# EAGLE design Smart bot V2.0 (EAGLE 9.6.2)
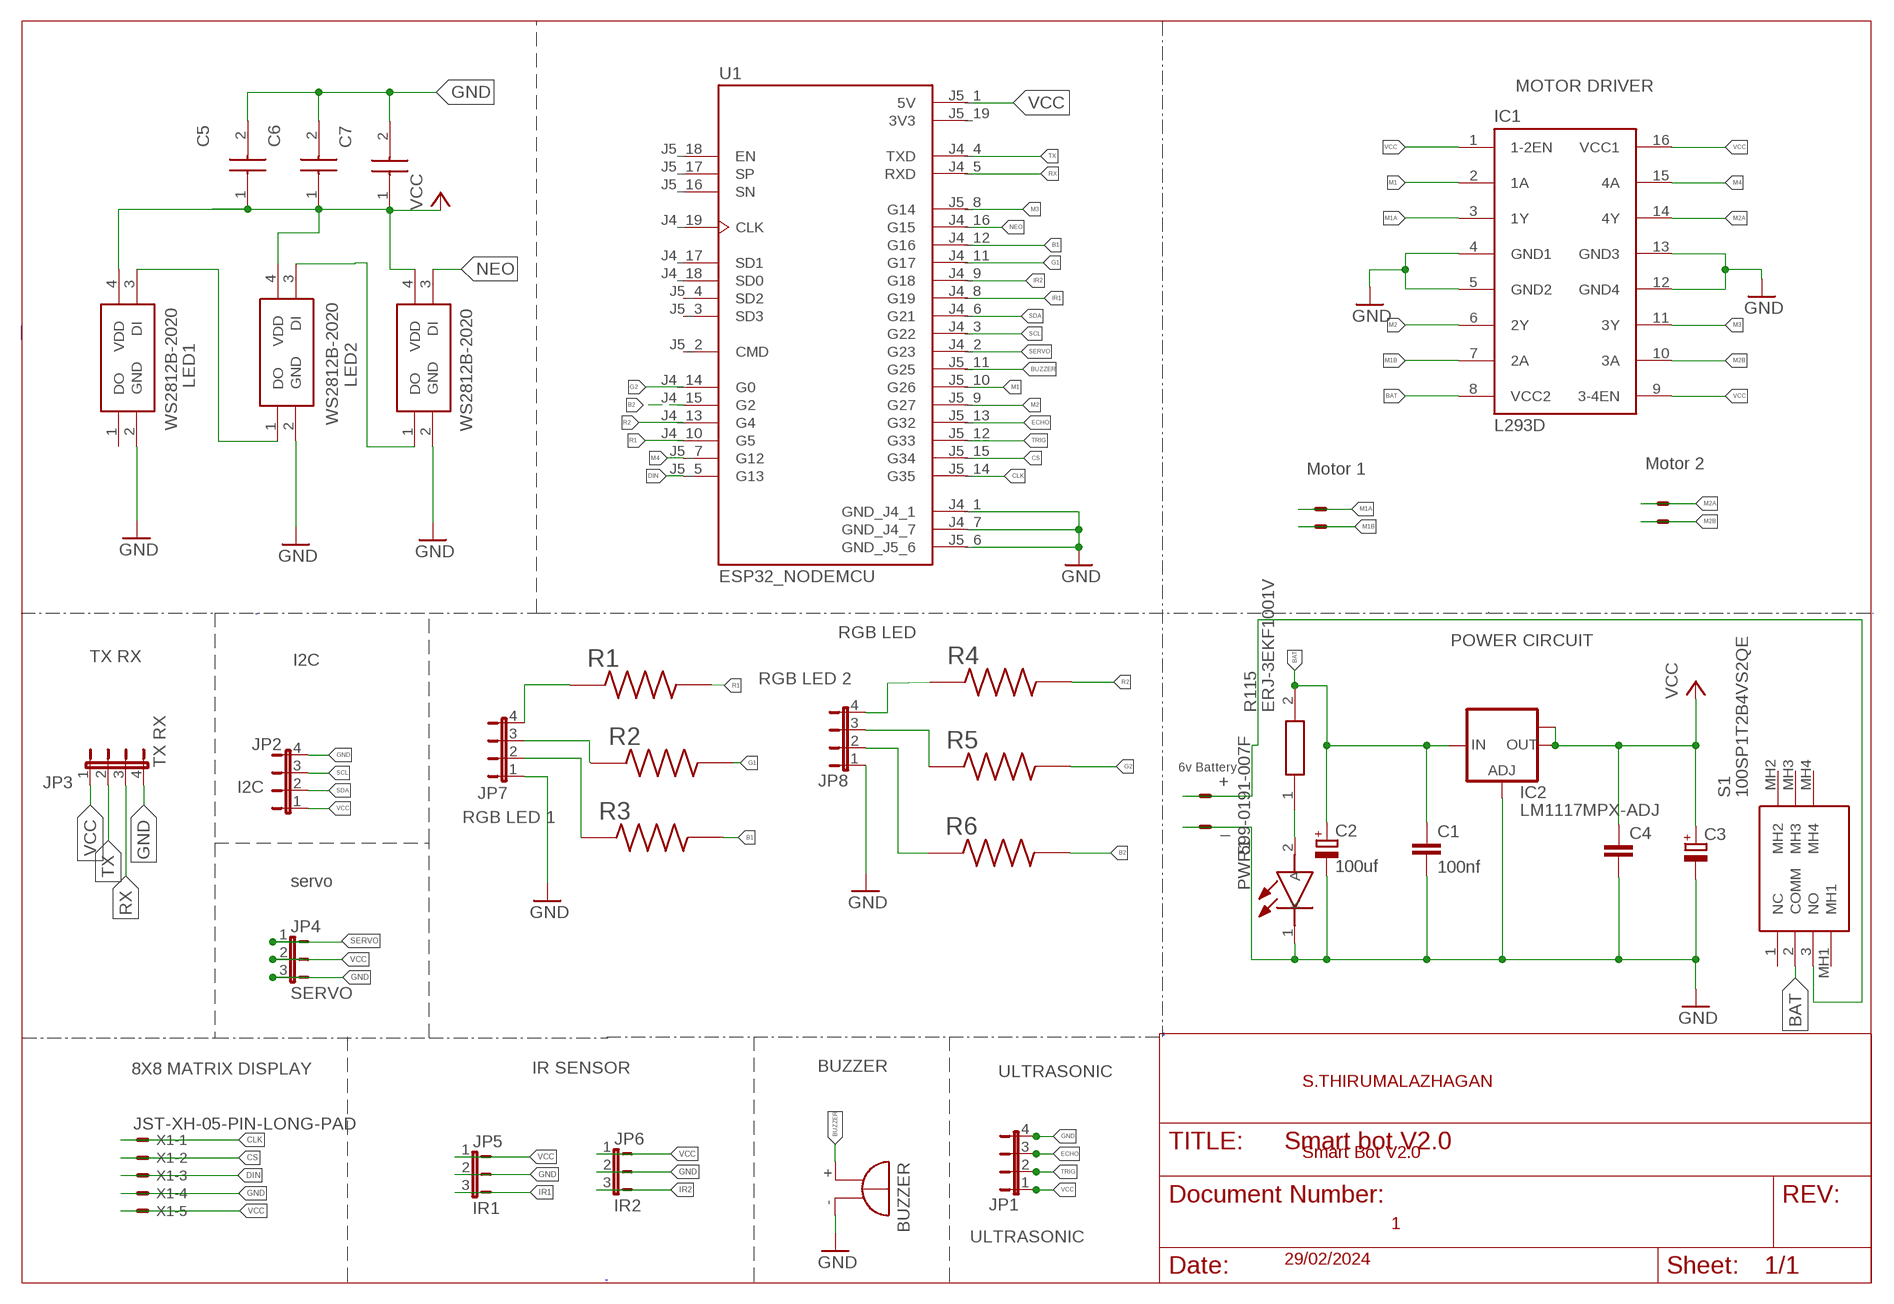
[diagram p0: schematic, sheet 1]

## Parts
6V  JST-XH-02-PIN-LONG-PAD  [JST-XH-02-PACKAGE-LONG-PAD]
BUZZER  F/HMB  [F/HMB]
C1  100nf  C-EUC1206  [C1206]
C2  100uf  CPOL-EUSMCB  [SMC_B]
C3  CPOL-EUSMCB  [SMC_B]
C4  C-EUC1206  [C1206]
C5  C0805X102KMRECAUTO7210  [CAPC2012X98N]
C6  C0805X102KMRECAUTO7210  [CAPC2012X98N]
C7  C0805X102KMRECAUTO7210  [CAPC2012X98N]
IC1  L293D  [DIL16]
IC2  LM1117MPX-ADJ  [SOT223]
JP1  ULTRASONIC  JP4E  [JP4]
JP2  I2C  JP4E  [JP4]
JP3  TX RX  JP4E  [JP4]
JP4  SERVO  JP2E  [JP2]
JP5  IR1  JP2E  [JP2]
JP6  IR2  JP2E  [JP2]
JP7  RGB LED 1  JP4E  [JP4]
JP8  RGB LED 2  JP4E  [JP4]
LED1  WS2812B-2020  [WS2812B2020]
LED2  WS2812B-2020  [WS2812B2020]
LED3  WS2812B-2020  [WS2812B2020]
PWR1  599-0191-007F  [LEDC2012X90N]
R1  RR0306P-101-D  [RESC0603X26N]
R2  RR0306P-101-D  [RESC0603X26N]
R3  RR0306P-101-D  [RESC0603X26N]
R4  RR0306P-101-D  [RESC0603X26N]
R5  RR0306P-101-D  [RESC0603X26N]
R6  RR0306P-101-D  [RESC0603X26N]
R115  ERJ-3EKF1001V  [RESC1608X55N]
S1  100SP1T2B4VS2QE  [100SP1T2B4VS2QE]
U1  ESP32_NODEMCU  [MODULE_ESP32_NODEMCU]
X1  JST-XH-05-PIN-LONG-PAD  [JST-XH-05-PACKAGE-LONG-PAD]
X2  JST-XH-02-PIN-LONG-PAD  [JST-XH-02-PACKAGE-LONG-PAD]
X3  JST-XH-02-PIN-LONG-PAD  [JST-XH-02-PACKAGE-LONG-PAD]

## Nets
6V: 6V.1 S1.3(NO)
B1: R3.2 U1.J4_12(G16)
B2: R6.2 U1.J4_15(G2)
BAT: C1.1 C2.+ IC1.8(VCC2) IC2.3(IN) R115.2 S1.2(COMM)
BUZZER: BUZZER.+ U1.J5_11(G25)
CLK: U1.J5_14(G35) X1.1
CS: U1.J5_15(G34) X1.2
DIN: U1.J5_5(G13) X1.3
ECHO: JP1.3 U1.J5_13(G32)
G1: R2.2 U1.J4_11(G17)
G2: R5.2 U1.J4_14(G0)
GND: 6V.2 BUZZER.- C1.2 C2.- C3.- C4.2 C5.2 C6.2 C7.2 IC1.4(GND1) IC1.5(GND2) IC1.12(GND4) IC1.13(GND3) IC2.1(ADJ) JP1.4 JP2.4 JP3.4 JP4.3 JP5.2 JP6.2 JP7.1 JP8.1 LED1.2(GND) LED2.2(GND) LED3.2(GND) PWR1.1(K) U1.J4_1(GND_J4_1) U1.J4_7(GND_J4_7) U1.J5_6(GND_J5_6) X1.4
IR1: JP5.3 U1.J4_8(G19)
IR2: JP6.3 U1.J4_9(G18)
M1: IC1.2(1A) U1.J5_10(G26)
M1A: IC1.3(1Y) X2.1
M1B: IC1.7(2A) X2.2
M2: IC1.6(2Y) U1.J5_9(G27)
M2A: IC1.14(4Y) X3.1
M2B: IC1.10(3A) X3.2
M3: IC1.11(3Y) U1.J5_8(G14)
M4: IC1.15(4A) U1.J5_7(G12)
N$1: JP7.4 R1.1
N$2: JP7.3 R2.1
N$3: JP7.2 R3.1
N$4: JP8.4 R4.1
N$5: JP8.3 R5.1
N$6: JP8.2 R6.1
N$7: PWR1.2(A) R115.1
N$9: LED1.3(DI) LED2.1(DO)
N$10: LED2.3(DI) LED3.1(DO)
NEO: LED3.3(DI) U1.J4_16(G15)
R1: R1.2 U1.J4_10(G5)
R2: R4.2 U1.J4_13(G4)
RX: JP3.3 U1.J4_5(RXD)
SCL: JP2.3 U1.J4_3(G22)
SDA: JP2.2 U1.J4_6(G21)
SERVO: JP4.1 U1.J4_2(G23)
TRIG: JP1.2 U1.J5_12(G33)
TX: JP3.2 U1.J4_4(TXD)
VCC: C3.+ C4.1 C5.1 C6.1 C7.1 IC1.1(1-2EN) IC1.9(3-4EN) IC1.16(VCC1) IC2.2(OUT) IC2.TAB(OUT1) JP1.1 JP2.1 JP3.1 JP4.2 JP5.1 JP6.1 LED1.4(VDD) LED2.4(VDD) LED3.4(VDD) U1.J5_1(5V) X1.5
Unconnected: LED1.1(DO) S1.1(NC) S1.MH1 S1.MH2 S1.MH3 S1.MH4 U1.J4_17(SD1) U1.J4_18(SD0) U1.J4_19(CLK) U1.J5_2(CMD) U1.J5_3(SD3) U1.J5_4(SD2) U1.J5_16(SN) U1.J5_17(SP) U1.J5_18(EN)

## Notes on the sheet
- MOTOR DRIVER
- Motor 2
- Motor 1
- RGB LED
- POWER CIRCUIT
- TX RX | I2C
- 6v Battery
- +
- _
- servo
- 8X8 MATRIX DISPLAY | IR SENSOR | BUZZER
- ULTRASONIC
- S.THIRUMALAZHAGAN
- Smart Bot V2.0
- 1
- 29/02/2024

## Power pins joined to a net without a drawn wire
3V3: U1.J5_19(3V3)

## Library data of the parts
6V X2 X3 = JST XH Connectors v1-0:JST-XH-02-PIN: JST XH Connector 2 Pin Wire to board connector. Pitch: 2,54 mm, (0.100") Number of pins: 2 Created by Rembrandt Electronics www.rembrandtelectronics.com
BUZZER = buzzer:F/HMB: BUZZER Source: Buerklin; OC_FARNELL: unknown; OC_NEWARK: unknown
C1 C4 = rcl:C-EU: CAPACITOR, European symbol; SPICEPREFIX: C
C2 C3 = rcl:CPOL-EU: POLARIZED CAPACITOR, European symbol; SPICEPREFIX: C
C5-C7 = SamacSys_Parts:C0805X102KMRECAUTO7210: Multilayer Ceramic Capacitors MLCC - SMD/SMT 63V 1000pF X7R 0805 10% AEC-Q200 Source: Datasheet <https://connect.kemet.com:7667/gateway/IntelliData-ComponentDocumentation/1.0/download/specsheet/C0805X102KMRECAUTO7210>; DESCRIPTION: Multilayer Ceramic Capacitors MLCC - SMD/SMT 63V 1000pF X7R 0805 10% AEC-Q200; HEIGHT: 0.98mm; MANUFACTURER_NAME: KEMET; MANUFACTURER_PART_NUMBER: C0805X102KMRECAUTO7210; MOUSER_PART_NUMBER: 80-C0805X102KMREAULR; MOUSER_PRICE-STOCK: https://www.mouser.co.uk/ProductDetail/KEMET/C0805X102KMRECAUTO7210?qs=MLItCLRbWszzMnEf80750Q%3D%3D
IC1 = st-microelectronics:L293D: PUSH-PULL 4 CHANNEL DRIVER; MPN: L293D; OC_FARNELL: 9589619; OC_NEWARK: 56P8249
IC2 = lm1117:LM1117MPX-ADJ
JP1-JP3 JP7 JP8 = jumper:JP4E: JUMPER
JP4-JP6 = jumper:JP2E: JUMPER
LED1-LED3 = SamacSys_Parts:WS2812B-2020: LED; SMD; 2020; RGB; 2x2x0.84mm; 3.75.3V; Lens: transparent; 2kHz Source: Datasheet <https://www.alldatasheet.com/datasheet-pdf/pdf/1134522/WORLDSEMI/WS2812B-2020.html>; DESCRIPTION: LED; SMD; 2020; RGB; 2x2x0.84mm; 3.75.3V; Lens: transparent; 2kHz; HEIGHT: 0.84mm; MANUFACTURER_NAME: Worldsemi; MANUFACTURER_PART_NUMBER: WS2812B-2020
PWR1 = SamacSys_Parts:599-0191-007F: Standard LEDs - SMD SMD 0805 BLUE Source: Datasheet <https://componentsearchengine.com/Datasheets/1/599-0191-007F.pdf>; DESCRIPTION: Standard LEDs - SMD SMD 0805 BLUE; HEIGHT: 0.9mm; MANUFACTURER_NAME: Dialight; MANUFACTURER_PART_NUMBER: 599-0191-007F; MOUSER_PART_NUMBER: 645-599-0191-007F; MOUSER_PRICE-STOCK: https://www.mouser.co.uk/ProductDetail/Dialight/599-0191-007F?qs=gTYE2QTfZfTbWzs5Ohdbbg%3D%3D
R1-R6 = RR0306P-101-D:RR0306P-101-D: Check availability <https://pricing.snapeda.com/parts/RR0306P-101-D/Susumu/view-part?ref=eda>; AVAILABILITY: In Stock; CHECK_PRICES: https://www.snapeda.com/parts/RR0306P-101-D/Susumu/view-part/?ref=eda; DESCRIPTION: 100 Ohms ±0.5% 0.05W, 1/20W Chip Resistor 0201 (0603 Metric) - Thin Film; MF: Susumu; MP: RR0306P-101-D; PACKAGE: 0603 Susumu; PRICE: None; PURCHASE-URL: https://www.snapeda.com/api/url_track_click_mouser/?unipart_id=4294534&manufacturer=Susumu&part_name=RR0306P-101-D&search_term=None; SNAPEDA_LINK: https://www.snapeda.com/parts/RR0306P-101-D/Susumu/view-part/?ref=snap
R115 = SamacSys_Parts:ERJ-3EKF1001V: Thick Film 0603 resistor 1K00 100mW 1% Panasonic ERJ3EK Series Precision Thick Film Surface Mount Resistor 0603 Case 1kOhm /-1% 0.1W /-100ppm/degC Source: Datasheet <http://industrial.panasonic.com/cdbs/www-data/pdf/RDA0000/AOA0000C86.pdf>; DESCRIPTION: Thick Film 0603 resistor 1K00 100mW 1% Panasonic ERJ3EK Series Precision Thick Film Surface Mount Resistor 0603 Case 1kOhm /-1% 0.1W /-100ppm/degC; HEIGHT: 0.55mm; MANUFACTURER_NAME: Panasonic; MANUFACTURER_PART_NUMBER: ERJ-3EKF1001V; MOUSER_PART_NUMBER: 667-ERJ-3EKF1001V; MOUSER_PRICE-STOCK: https://www.mouser.co.uk/ProductDetail/Panasonic/ERJ-3EKF1001V?qs=H7k1u0Mp9JTM8yQxOuvoDg%3D%3D
S1 = SamacSys_Parts:100SP1T2B4VS2QE: E-SWITCH - 100SP1T2B4VS2QE - SWITCH, TOGGLE, SPDT, 5A, 120VAC, 28VDC Source: Datasheet <http://spec_sheets.e-switch.com/specs/T111093.pdf>; DESCRIPTION: E-SWITCH - 100SP1T2B4VS2QE - SWITCH, TOGGLE, SPDT, 5A, 120VAC, 28VDC; HEIGHT: 25.24mm; MANUFACTURER_NAME: E-Switch; MANUFACTURER_PART_NUMBER: 100SP1T2B4VS2QE; MOUSER_PART_NUMBER: 612-100SP1T2B4VSQ; MOUSER_PRICE-STOCK: https://www.mouser.co.uk/ProductDetail/E-Switch/100SP1T2B4VS2QE?qs=HKd%2Fp3M7KlVLonduqwmVDQ%3D%3D
U1 = ESP32_NODEMCU:ESP32_NODEMCU: Check availability <https://pricing.snapeda.com/parts/ESP32%20NODEMCU/AZ%20Delivery/view-part?ref=eda>; AVAILABILITY: Not in stock; CHECK_PRICES: https://www.snapeda.com/parts/ESP32%20NODEMCU/AZ-Delivery/view-part/?ref=eda; DESCRIPTION: NodeMCU is an open source loT platform. ESP32 is a series of low cost, low power system-on-chip (SoC) microcontrollers with integrated Wi-Fi & dual-mode Bluetooth.; MF: AZ Delivery; MP: ESP32 NODEMCU; PACKAGE: Package; PRICE: None; SNAPEDA_LINK: https://www.snapeda.com/parts/ESP32%20NODEMCU/AZ-Delivery/view-part/?ref=snap
X1 = JST XH Connectors v1-0:JST-XH-05-PIN: JST XH Connector 2 Pin Wire to board connector. Pitch: 2,54 mm, (0.100") Number of pins: 5 Created by Rembrandt Electronics www.rembrandtelectronics.com

## Board
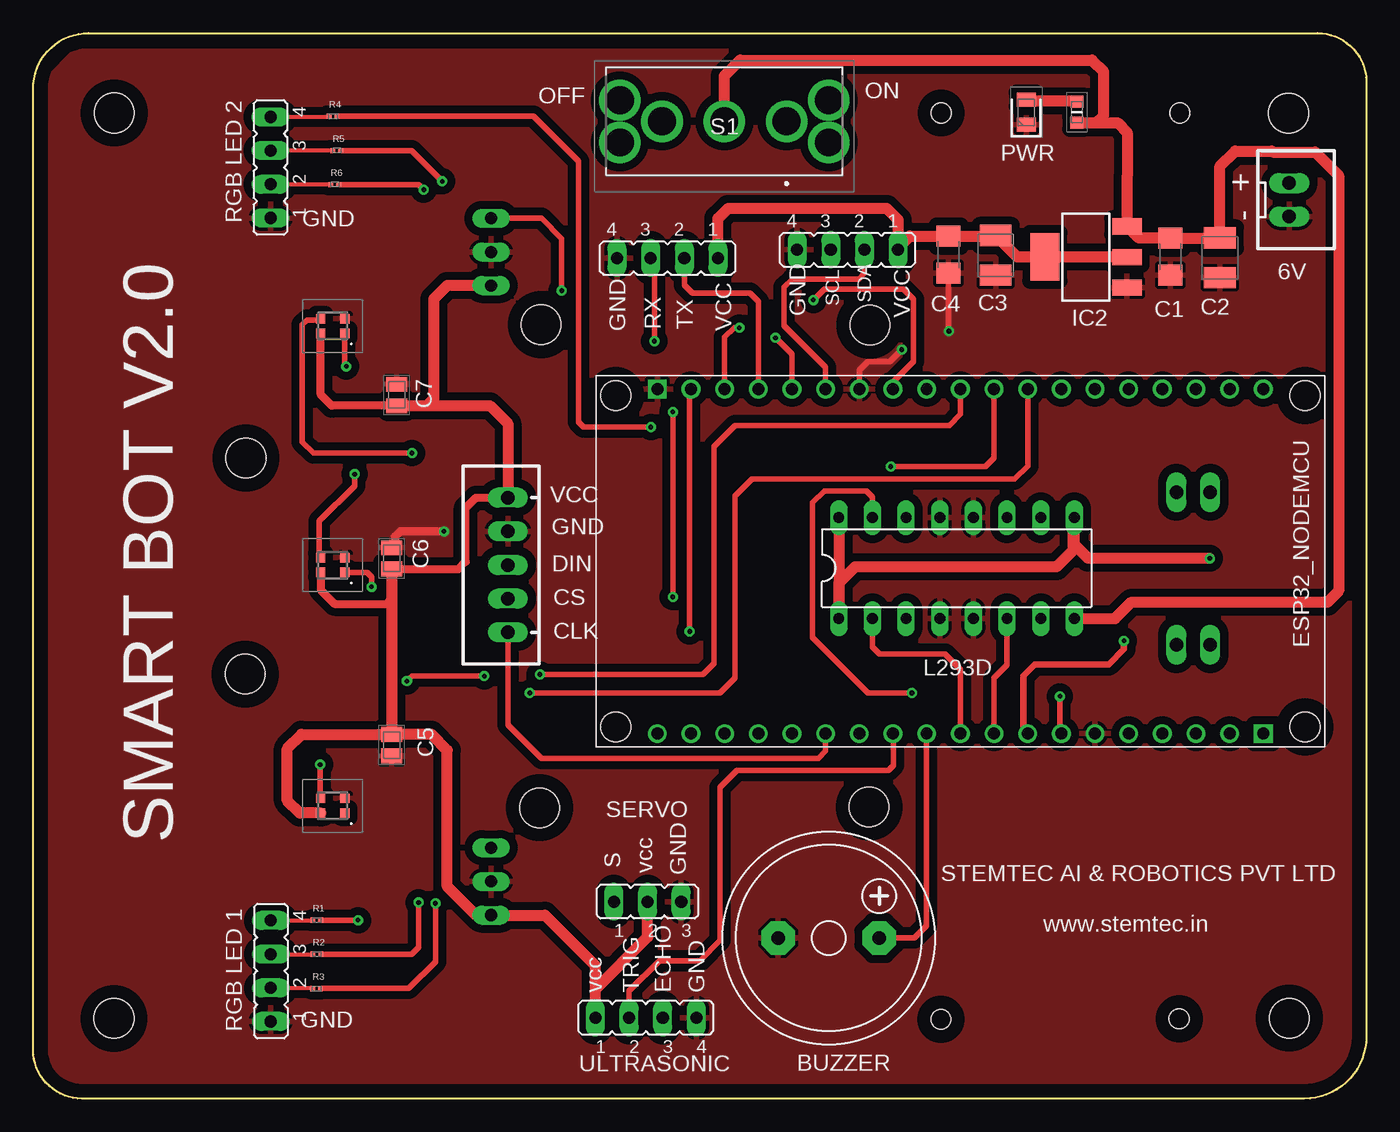
[diagram p1: board, top side]
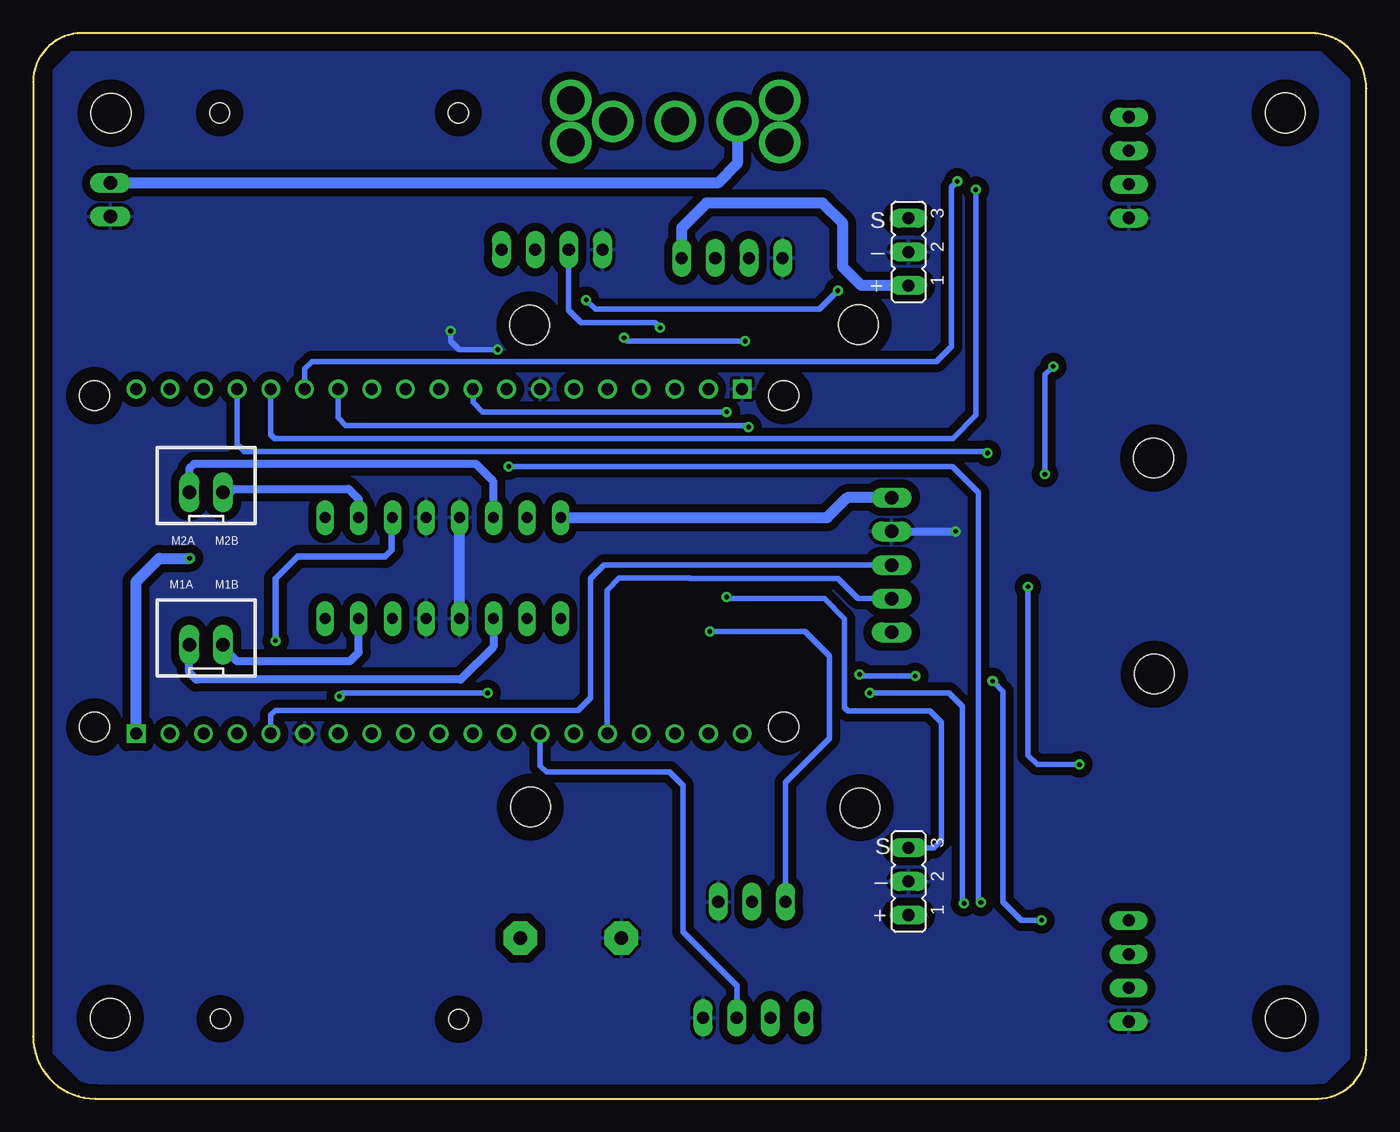
[diagram p2: board, bottom side, seen from below]

Size 100.58 x 80.39 mm. Coordinates in mm from the lower left corner, seen from the top.
Outline: 0,3.68 0,76.2 arc-90 4.19,80.39 96.9,80.39 arc-90 100.58,76.71 100.58,4.7 arc-90 95.89,0 3.68,0 arc-90 0,3.68
Copper layers (1*16): Top 0.035mm / dielectric 1.5mm / Bottom 0.035mm
Design rules "default *": minimum track width 6mil, minimum drill 0.35mm, track to track 8mil, track to pad 8mil, pad to pad 8mil, via to via 8mil, smd to smd 8mil, copper to edge 40mil, drill to drill 6mil, minimum pad ring 10mil, minimum via ring 8mil, stop-mask expansion 4mil, vias tented up to drill 0mil, thermal gap 10mil
Holes 3 mm at 6.1,6.05 6.12,74.37 94.77,6.07 94.72,74.35 38.33,58.39 63.12,58.37 63.07,22 16.05,48.34 16,32.03 38.2,21.95
Holes 1.5 mm at 68.5,74.37 86.51,74.37 68.48,5.99 86.46,6.02

### Footprints (pad centres in the part's own frame; a part is rotated, then mirrored left to right if it is on the bottom)
JST-XH-02-PACKAGE-LONG-PAD = drill 1.016 long: 1 -1.27,0; 2 1.27,0
F/HMB = drill 1.016 pad 2.54 octagon: + 3.81,0; - -3.81,0
C1206 = smd 1.6 x 1.8: 1 -1.4,0; 2 1.4,0
SMC_B = smd 1.6 x 2.4: + -1.5,0; - 1.5,0
CAPC2012X98N = smd 1.1 x 1.57: 1 -0.81,0; 2 0.81,0
DIL16 = drill 0.813 long: 1 -8.89,-3.81; 2 -6.35,-3.81; 3 -3.81,-3.81; 4 -1.27,-3.81; 5 1.27,-3.81; 6 3.81,-3.81; 7 6.35,-3.81; 8 8.89,-3.81; 9 8.89,3.81; 10 6.35,3.81; 11 3.81,3.81; 12 1.27,3.81; 13 -1.27,3.81; 14 -3.81,3.81; 15 -6.35,3.81; 16 -8.89,3.81
SOT223 = smd 1.219 x 2.235: 1 -2.311,-3.099; 2 0,-3.099; 3 2.311,-3.099 | smd 3.6 x 2.2: TAB 0,3.099
JP4 = drill 0.914 long: 1 -3.81,0; 2 -1.27,0; 3 1.27,0; 4 3.81,0
JP2 = drill 0.914 long: 1 -2.54,0; 2 0,0; 3 2.54,0
WS2812B2020 = smd 0.7 x 0.7: 1 0.915,-0.55; 2 0.915,0.55; 3 -0.915,0.55; 4 -0.915,-0.55
LEDC2012X90N = smd 1.05 x 1.45: 1 -0.95,0; 2 0.95,0
RESC0603X26N = smd 0.35 x 0.4: 1 -0.295,0; 2 0.295,0
RESC1608X55N = smd 0.9 x 1: 1 -0.8,0; 2 0.8,0
100SP1T2B4VS2QE = drill 2.1 pad 3.15: 1 0,0; 2 0,4.7; 3 0,9.4 | drill 2.1 pad 2.8: MH1 -1.59,-3.175; MH2 1.59,-3.175; MH3 1.59,12.575; MH4 -1.59,12.575
MODULE_ESP32_NODEMCU = drill 0.9 pad 1.35 square: J4_1 13,22.86; J5_1 -13,-22.86 | drill 0.9 pad 1.35: J4_2 13,20.32; J4_3 13,17.78; J4_4 13,15.24; J4_5 13,12.7; J4_6 13,10.16; J4_7 13,7.62; J4_8 13,5.08; J4_9 13,2.54; J4_10 13,0; J4_11 13,-2.54; J4_12 13,-5.08; J4_13 13,-7.62; J4_14 13,-10.16; J4_15 13,-12.7; J4_16 13,-15.24; J4_17 13,-17.78; J4_18 13,-20.32; J4_19 13,-22.86; J5_2 -13,-20.32; J5_3 -13,-17.78; J5_4 -13,-15.24; J5_5 -13,-12.7; J5_6 -13,-10.16; J5_7 -13,-7.62; J5_8 -13,-5.08; J5_9 -13,-2.54; J5_10 -13,0; J5_11 -13,2.54; J5_12 -13,5.08; J5_13 -13,7.62; J5_14 -13,10.16; J5_15 -13,12.7; J5_16 -13,15.24; J5_17 -13,17.78; J5_18 -13,20.32; J5_19 -13,22.86 | hole 2.25: -12.5,-26; 12.5,-26; -12.5,26; 12.5,26
JST-XH-05-PACKAGE-LONG-PAD = drill 1.016 long: 1 -5.08,0; 2 -2.54,0; 3 0,0; 4 2.54,0; 5 5.08,0

### Placement (x,y rotation side)
6V  94.77,67.82 270 top
BUZZER  60.02,12.12 0 top
C1  85.8,63.53 270 top
C2  89.53,63.45 270 top
C3  72.62,63.63 270 top
C4  69.06,63.68 270 top
C5  27.05,40.77 90 top
C6  27.05,26.67 270 top
C7  27.43,53.09 90 top
IC1  69.67,40.03 0 top
IC2  79.43,63.5 90 top
JP1  46.23,6.1 0 top
JP2  61.44,64.06 180 top
JP3  47.85,63.42 180 top
JP4  46.35,14.86 0 top
JP5  34.54,63.88 90 bottom
JP6  34.54,16.38 90 bottom
JP7  17.93,9.63 90 top
JP8  17.91,70.26 90 top
LED1  22.61,22.1 0 top
LED2  22.61,40.26 0 top
LED3  22.61,58.29 0 top
PWR1  74.93,74.42 90 top
R1  21.41,13.46 0 top
R2  21.41,10.9 0 top
R3  21.39,8.31 0 top
R4  22.63,74.12 0 top
R5  22.91,71.53 0 top
R6  22.76,68.96 0 top
R115  78.74,74.42 270 top
S1  56.85,73.74 90 top
U1  69.95,40.54 90 top
X1  35.81,40.26 90 top
X2  87.53,34.24 0 bottom
X3  87.53,45.75 0 bottom

### Tracks (layer width: path | path; a pad name or v marks a point on that pad's centre or on a via)
6V
  Bottom 0.813: S1.3 47.45,70.56 48.92,69.09 6V.1
B1  (via drill 0.35)
  Top 0.152: R3.2 21.72,8.31 22.23,8.31
  Top 0.406: U1.J4_12 75.03,47.73 74.04,46.74 54.23,46.74 52.96,45.47 52.96,31.75 51.82,30.61 v37.47,30.61 | 21.72,8.31 28.32,8.31 30.35,10.34 v30.35,14.73
  Bottom 0.406: v37.47,30.61 31.5,30.61 30.48,29.59 30.48,14.73 v30.35,14.73
B2  (via drill 0.35)
  Top 0.406: R6.2 29.08,68.96 v29.46,68.58
  Bottom 0.406: v29.46,68.58 29.46,51.56 31.21,49.82 82.36,49.82 82.65,50.11 U1.J4_15
BAT
  Top 0.152: 78.74,73.34 R115.2
  Top 0.813: S1.2 52.15,77.16 53.34,78.36 79.88,78.36 80.77,77.47 80.77,74.17 80.22,73.62 R115.2 81.83,73.62 82.55,72.9 82.55,69.58 82.53,69.56 IC2.3 83.41,64.92 C1.1 89.51,64.92 C2.+ 89.53,70.36 90.68,71.5 93.43,71.5 93.51,71.42 96.72,71.42 98.5,69.65 98.5,38.3 97.66,37.47 82.86,37.47 81.61,36.22 IC1.8
BUZZER
  Top 0.406: BUZZER.+ 66.5,12.12 67.41,13.03 U1.J5_11
  Bottom 0.152: 67.31,27.3 U1.J5_11
CLK
  Top 0.406: U1.J5_14 59.79,26.22 59.24,25.67 38.34,25.67 35.81,28.19 X1.1
CS
  Bottom 0.406: X1.2 38.35,37.72 39.88,39.24 51.02,39.24 51.05,39.27 56.37,39.27 57.28,38.35 57.28,27.56 U1.J5_15
DIN
  Bottom 0.406: U1.J5_5 82.65,28.93 82.3,29.28 59.49,29.28 58.55,30.23 58.55,39.24 57.53,40.26 X1.3
ECHO
  Bottom 0.152: 47.62,6.35 JP1.3
  Bottom 0.406: JP1.3 47.5,8.51 51.56,12.57 51.56,23.62 52.58,24.64 61.85,24.64 62.33,25.12 U1.J5_13
G1  (via drill 0.35)
  Top 0.152: R2.2 21.97,10.9
  Top 0.406: 21.97,10.9 28.55,10.9 29.08,11.43 v29.08,14.8 | U1.J4_11 72.49,48.33 71.85,47.69 v64.71,47.69
  Bottom 0.406: v29.08,14.8 29.27,14.99 29.27,45.72 31.24,47.69 v64.71,47.69
G2  (via drill 0.35)
  Top 0.406: v30.86,69.22 28.55,71.53 R5.2
  Bottom 0.406: U1.J4_14 80.11,55.06 79.55,55.63 32.43,55.63 31.32,56.73 31.32,68.76 v30.86,69.22
GND  (via drill 0.35)
  Top 0.152: 23.81,22.86 LED1.2 | 26.99,26.04 C6.2 | 23.81,58.74 LED3.2 23.5,59.05 | 27.3,53.98 C7.2 | C2.- 89.64,62.39 | 23.81,40.96 LED2.2 | 26.99,41.27 C5.2 27.3,41.59 | 69.09,62.42 C4.2 | 72.33,62.29 C3.-
  Top 0.406: U1.J4_7 62.33,54.97 62.99,55.63 64.64,55.63 v65.53,56.52 | v69.09,57.91 69.06,57.94 C4.2
  Top 0.61: v30.99,42.8 27.69,42.8 27.3,42.42 27.3,41.59
  Top 0.813: C3.- 72.62,62.27
  Bottom 0.152: 49.02,14.86 JP4.3
  Bottom 0.406: v65.53,56.52 68.45,56.52 69.09,57.15 v69.09,57.91
  Bottom 0.61: X1.4 v30.99,42.8
  Bottom 0.813: IC1.4 IC1.13
  pour Top (isolate 0.61): 0.99,2.95 0.99,76.81 3.3,79.12 99.82,79.12 99.82,3.43 97.41,1.02 2.92,1.02
  pour Bottom (isolate 0.61): 1.27,3.05 1.27,76.83 3.43,78.99 97.66,78.99 99.06,77.6 99.06,3.43 96.65,1.02 3.3,1.02
IR1  (via drill 0.35)
  Top 0.406: U1.J4_8 64.87,54.08 66.42,55.63 66.42,60.33 65.66,61.09 59.69,61.09 v58.86,60.26 | JP5.3 38.35,66.42 39.88,64.9 v39.88,60.96
  Bottom 0.406: v58.86,60.26 58.17,59.56 41.27,59.56 v39.88,60.96
IR2  (via drill 0.35)
  Top 0.406: v48.26,37.85 v48.26,51.82
  Bottom 0.406: v48.26,37.85 48.13,37.72 40.89,37.72 39.37,36.2 39.37,29.5 39.12,29.25 32.93,29.25 32.05,28.37 32.05,19.51 32.64,18.92 JP6.3 | v48.26,51.82 66.67,51.82 67.41,52.55 U1.J4_9
M1
  Top 0.406: U1.J5_10 69.95,32.38 68.78,33.55 63.83,33.55 63.32,34.06 IC1.2
M1A
  Bottom 0.61: IC1.3 65.86,34.09 68.33,31.62 88.27,31.62 88.8,32.16 X2.1
M1B
  Bottom 0.61: X2.2 86.26,34.06 85.22,33.02 76.68,33.02 76.02,33.68 IC1.7
M2
  Top 0.406: IC1.6 73.48,32.72 72.49,31.73 U1.J5_9
M2A
  Bottom 0.61: IC1.14 65.86,46.56 67.18,47.88 88.44,47.88 88.8,47.52 X3.1
M2B
  Bottom 0.61: IC1.10 76.02,45.24 76.78,46 85.47,46 85.72,45.74 X3.2
M3  (via drill 0.35)
  Top 0.406: U1.J5_8 74.7,27.87
  Top 0.508: 74.7,27.87 74.7,31.9 75.56,32.77 81.15,32.77 82.3,33.91 v82.3,34.54
  Bottom 0.508: v82.3,34.54 82.3,39.24 80.64,40.89 74.04,40.89 73.53,41.4 73.53,43.79 IC1.11
M4  (via drill 0.35)
  Top 0.406: IC1.15 63.32,45.39 62.87,45.85 59.69,45.85 58.8,44.96 58.8,34.8 62.99,30.61 v66.29,30.61 | v77.47,30.35 77.47,27.64 U1.J5_7
  Bottom 0.406: v66.29,30.61 77.22,30.61 v77.47,30.35
N$1
  Top 0.305: JP7.4 21.09,13.44 R1.1
N$2
  Top 0.305: JP7.3 R2.1
N$3
  Top 0.305: JP7.2 21.04,8.36 R3.1
N$4
  Top 0.152: 22.42,73.98 R4.1
  Top 0.305: R4.1 22.29,74.07 JP8.4
N$5
  Top 0.305: 22.65,71.5 R5.1 JP8.3
N$6
  Top 0.305: JP8.2 22.44,68.99 R6.1
N$7
  Top 0.152: 74.93,75.25 PWR1.2
  Top 0.813: R115.1 78.72,75.25 74.93,75.25
N$9  (via drill 0.35)
  Top 0.152: 23.81,39.69 LED2.1
  Top 0.406: LED2.1 25.19,39.71 25.53,39.37 v25.53,38.61 | v21.65,25.21 21.65,22.81 21.69,22.77 LED1.3
  Bottom 0.406: v25.53,38.61 25.53,25.91 24.83,25.21 v21.65,25.21
N$10  (via drill 0.35)
  Top 0.152: LED2.3 21.59,40.96 | 23.5,57.47 LED3.1
  Top 0.406: 21.59,40.96 21.59,43.56 24.26,46.23 v24.26,47.12 | v23.62,55.24 23.5,55.37 23.5,57.47
  Bottom 0.406: v24.26,47.12 24.26,54.61 v23.62,55.24
NEO  (via drill 0.35)
  Top 0.152: 21.59,58.74 LED3.3
  Top 0.406: LED3.3 21.6,58.75 20.66,58.75 20.3,58.39 20.3,49.55 21.14,48.7 v28.57,48.7
  Bottom 0.406: v28.57,48.7 28.7,48.83 84.64,48.83 85.19,49.38 U1.J4_16
R1  (via drill 0.35)
  Top 0.406: U1.J4_10 69.95,51.63 69.12,50.8 52.96,50.8 51.37,49.21 51.37,32.83 50.55,32 v38.23,32 | v24.51,13.46 R1.2 | v34.04,31.88 28.57,31.88 v28.19,31.5
  Bottom 0.406: v24.51,13.46 26.04,13.46 27.43,14.86 27.43,30.73 v28.19,31.5 | v34.04,31.88 38.1,31.88 v38.23,32
R2  (via drill 0.35)
  Top 0.152: 23.05,73.98 R4.2
  Top 0.406: R4.2 37.77,74.12 41.15,70.74 41.15,51.05 41.53,50.67 v46.61,50.67
  Bottom 0.406: v46.61,50.67 46.74,50.8 76.99,50.8 77.57,51.38 U1.J4_13
RX  (via drill 0.35)
  Top 0.406: U1.J4_5 57.25,56.16 v56.01,57.4 | v46.86,57.15 46.86,63.14 JP3.3
  Bottom 0.406: v56.01,57.4 55.75,57.15 v46.86,57.15
SCL  (via drill 0.35)
  Top 0.406: U1.J4_3 52.17,57.44 52.9,58.17 v53.28,58.17
  Bottom 0.406: v53.28,58.17 53.66,58.55 59.23,58.55 60.17,59.49 JP2.3
SDA
  Top 0.406: U1.J4_6 59.79,55.19 56.64,58.34 56.64,61.21 57.28,61.85 62.29,61.85 62.71,62.27 JP2.2
SERVO  (via drill 0.35)
  Top 0.152: 49.53,53.34 U1.J4_2
  Top 0.406: v49.53,35.24 49.53,53.44 U1.J4_2
  Bottom 0.406: JP4.1 43.81,23.88 40.51,27.18 40.51,33.4 42.35,35.24 v49.53,35.24
TRIG
  Top 0.406: JP1.2 44.96,8.13 47.24,10.41 50.29,10.41 51.82,11.94 51.82,23.5 53.09,24.77 64.52,24.77 64.9,25.15 64.9,27.51 U1.J5_12
TX
  Top 0.406: JP3.2 49.12,61.39 49.76,60.76 54.08,60.76 54.71,60.12 U1.J4_4
VCC  (via drill 0.35)
  Top 0.152: 78.49,43.81 IC1.9 | 26.86,27.5 26.99,27.62 C6.1 27.3,27.62 | 65.26,64.03 JP2.1
  Top 0.61: C5.1 32.08,39.96 32.64,40.51 32.64,44.58 33.4,45.34 X1.5 | LED2.4 21.69,38.38 22.73,37.34 26.67,37.34 27.05,37.72 | LED3.4 21.69,53.11 22.53,52.28 C7.1
  Top 0.813: C4.1 69.11,65.03 | JP3.1 51.66,66.4 52.45,67.18 64.39,67.18 65.26,66.31 65.26,64.03 | 27.05,39.12 C5.1 27.05,37.72 27.05,27.69 26.86,27.5 | IC1.16 IC1.1 60.78,38.89 62.03,40.13 77.22,40.13 78.49,41.4 78.49,43.81 | C7.1 29.72,52.28 | 29.72,52.28 34.47,52.28 35.81,50.93 X1.5 | v88.77,40.77 79.6,40.77 78.56,41.81 IC1.9 | 46.28,14.94 JP4.2 46.35,12.19 42.42,8.26 JP1.1 42.42,10.03 38.61,13.84 JP6.1 33.4,13.84 31.24,16 31.24,26.29 30.05,27.48 C6.1 20.24,27.48 19.18,26.42 19.18,22.48 20.11,21.55 LED1.4 | C4.1 72.57,65.08 C3.+ 74.25,63.5 IC2.TAB IC2.2 | JP2.1 65.25,64.19 66.14,65.08 C4.1 | 29.72,52.28 30.23,52.78 30.23,60.33 31.24,61.34 JP5.1
  Bottom 0.813: IC1.16 40.68,43.84 39.18,45.34 X1.5 | U1.J5_1 92.81,39.01 91.06,40.77 v88.77,40.77 | JP3.1 51.66,65.68 49.78,67.56 41.02,67.56 39.5,66.04 39.5,62.74 38.1,61.34 JP5.1

### Text on the board
tNames: OFF | ON | PWR | + | GND | - | SCL | SDA | GND | VCC | GND | RX | TX | VCC | VCC | GND | C6 | DIN | CS | CLK | C5 | SMART BOT V2.0 | S | vcc | GND | STEMTEC AI & ROBOTICS PVT LTD | www.stemtec.in | vcc | TRIG | ECHO | GND | GND
bNames: S | _ | + | M2B | M2A | M1B | M1A | S | _ | +